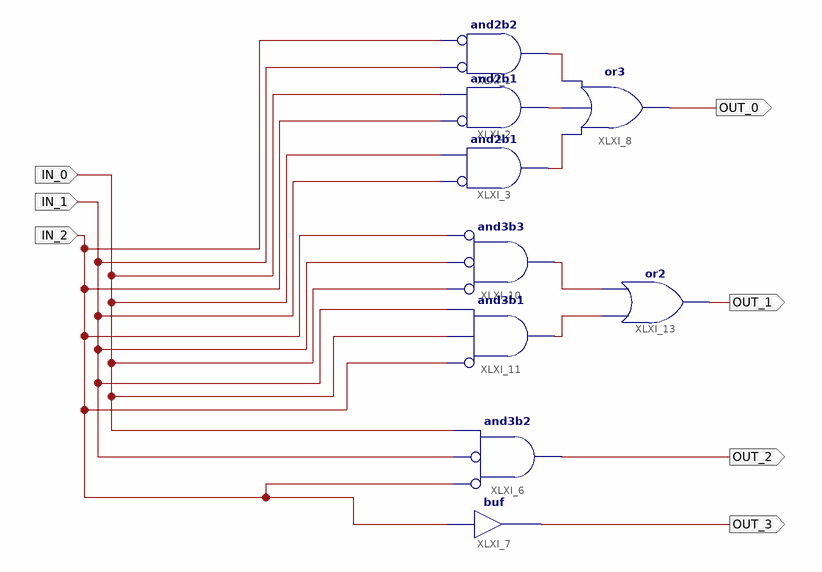
[diagram p0: schematic sheet 1]
// Xilinx ISE schematic Decoder3to4.sch (spartan3a) as structural Verilog: 9 symbols, 7 ports
module Decoder3to4 (
  input  IN_1,
  input  IN_0,
  input  IN_2,
  output OUT_3,
  output OUT_2,
  output OUT_0,
  output OUT_1
);

  wire XLXN_16, XLXN_17, XLXN_18, XLXN_49, XLXN_50;

  and XLXI_1 (XLXN_16, ~IN_1, ~IN_2);  // and2b2
  and XLXI_2 (XLXN_17, ~IN_2, IN_0);  // and2b1
  and XLXI_3 (XLXN_18, ~IN_1, IN_0);  // and2b1
  and XLXI_10 (XLXN_49, ~IN_0, ~IN_1, ~IN_2);  // and3b3
  and XLXI_11 (XLXN_50, ~IN_2, IN_0, IN_1);  // and3b1
  and XLXI_6 (OUT_2, ~IN_2, ~IN_1, IN_0);  // and3b2
  buf XLXI_7 (OUT_3, IN_2);
  or XLXI_8 (OUT_0, XLXN_18, XLXN_17, XLXN_16);
  or XLXI_13 (OUT_1, XLXN_50, XLXN_49);
endmodule
